# Altium schematic sheet Sch_Dr_LD .SchDoc
size A4 portrait; Address3: ULY
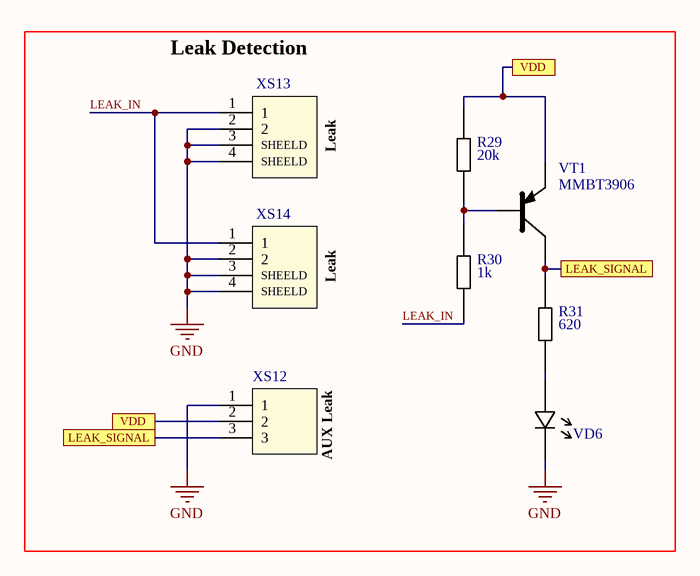
[diagram p0: Sch_Dr_LD .SchDoc]

## Parts
R29  20k  [Res_0603]
R30  1k  [Res_0603]
R31  620  [Res_0603]
VD6  TO-1608BC-PG  [0603_LED]  (value not drawn)
VT1  MMBT3906  [SOT-23-3]
XS12  PLS-3  [3X]  (value not drawn)
XS13  BM02B-GHS-TBT(LF)(SN)(N)  [BM02B-GHS-TBT]  (value not drawn)
XS14  BM02B-GHS-TBT(LF)(SN)(N)  [BM02B-GHS-TBT]  (value not drawn)

## Ports
LEAK_SIGNAL, VDD

## Nets
GND: VD6.1(K) XS12.1 XS13.2 XS13.3(SHEELD) XS13.4(SHEELD) XS14.2 XS14.3(SHEELD) XS14.4(SHEELD)
LEAK_IN: R30.2 XS13.1 XS14.1
LEAK_SIGNAL: R31.1 VT1.3(C) XS12.3 ; port LEAK_SIGNAL
VDD: R29.1 VT1.2(E) XS12.2 ; port VDD
NetR29_2: R29.2 R30.1 VT1.1(B)
NetR31_2: R31.2 VD6.2(A)

## Notes on the sheet
- (near XS13) Leak Detection
- Leak
- AUX Leak
- Title
- Size:
- Date:
- A4
- Number:
- Time:
- Revision:
- Sheet
- of
- File:

## Library data of the parts
R29 = Res_: CR-03FL7---20K
R30 = Res_: CR-03FL7----1K
R31 = Res_: CR-03FL7--620R
VD6 = LED_: SMD LED Green
VT1 = MMBT3906: SOT-23, 40V, 0.2A, NPN Bipolar Transistor